# EAGLE design sensorline (EAGLE 8.1.0)
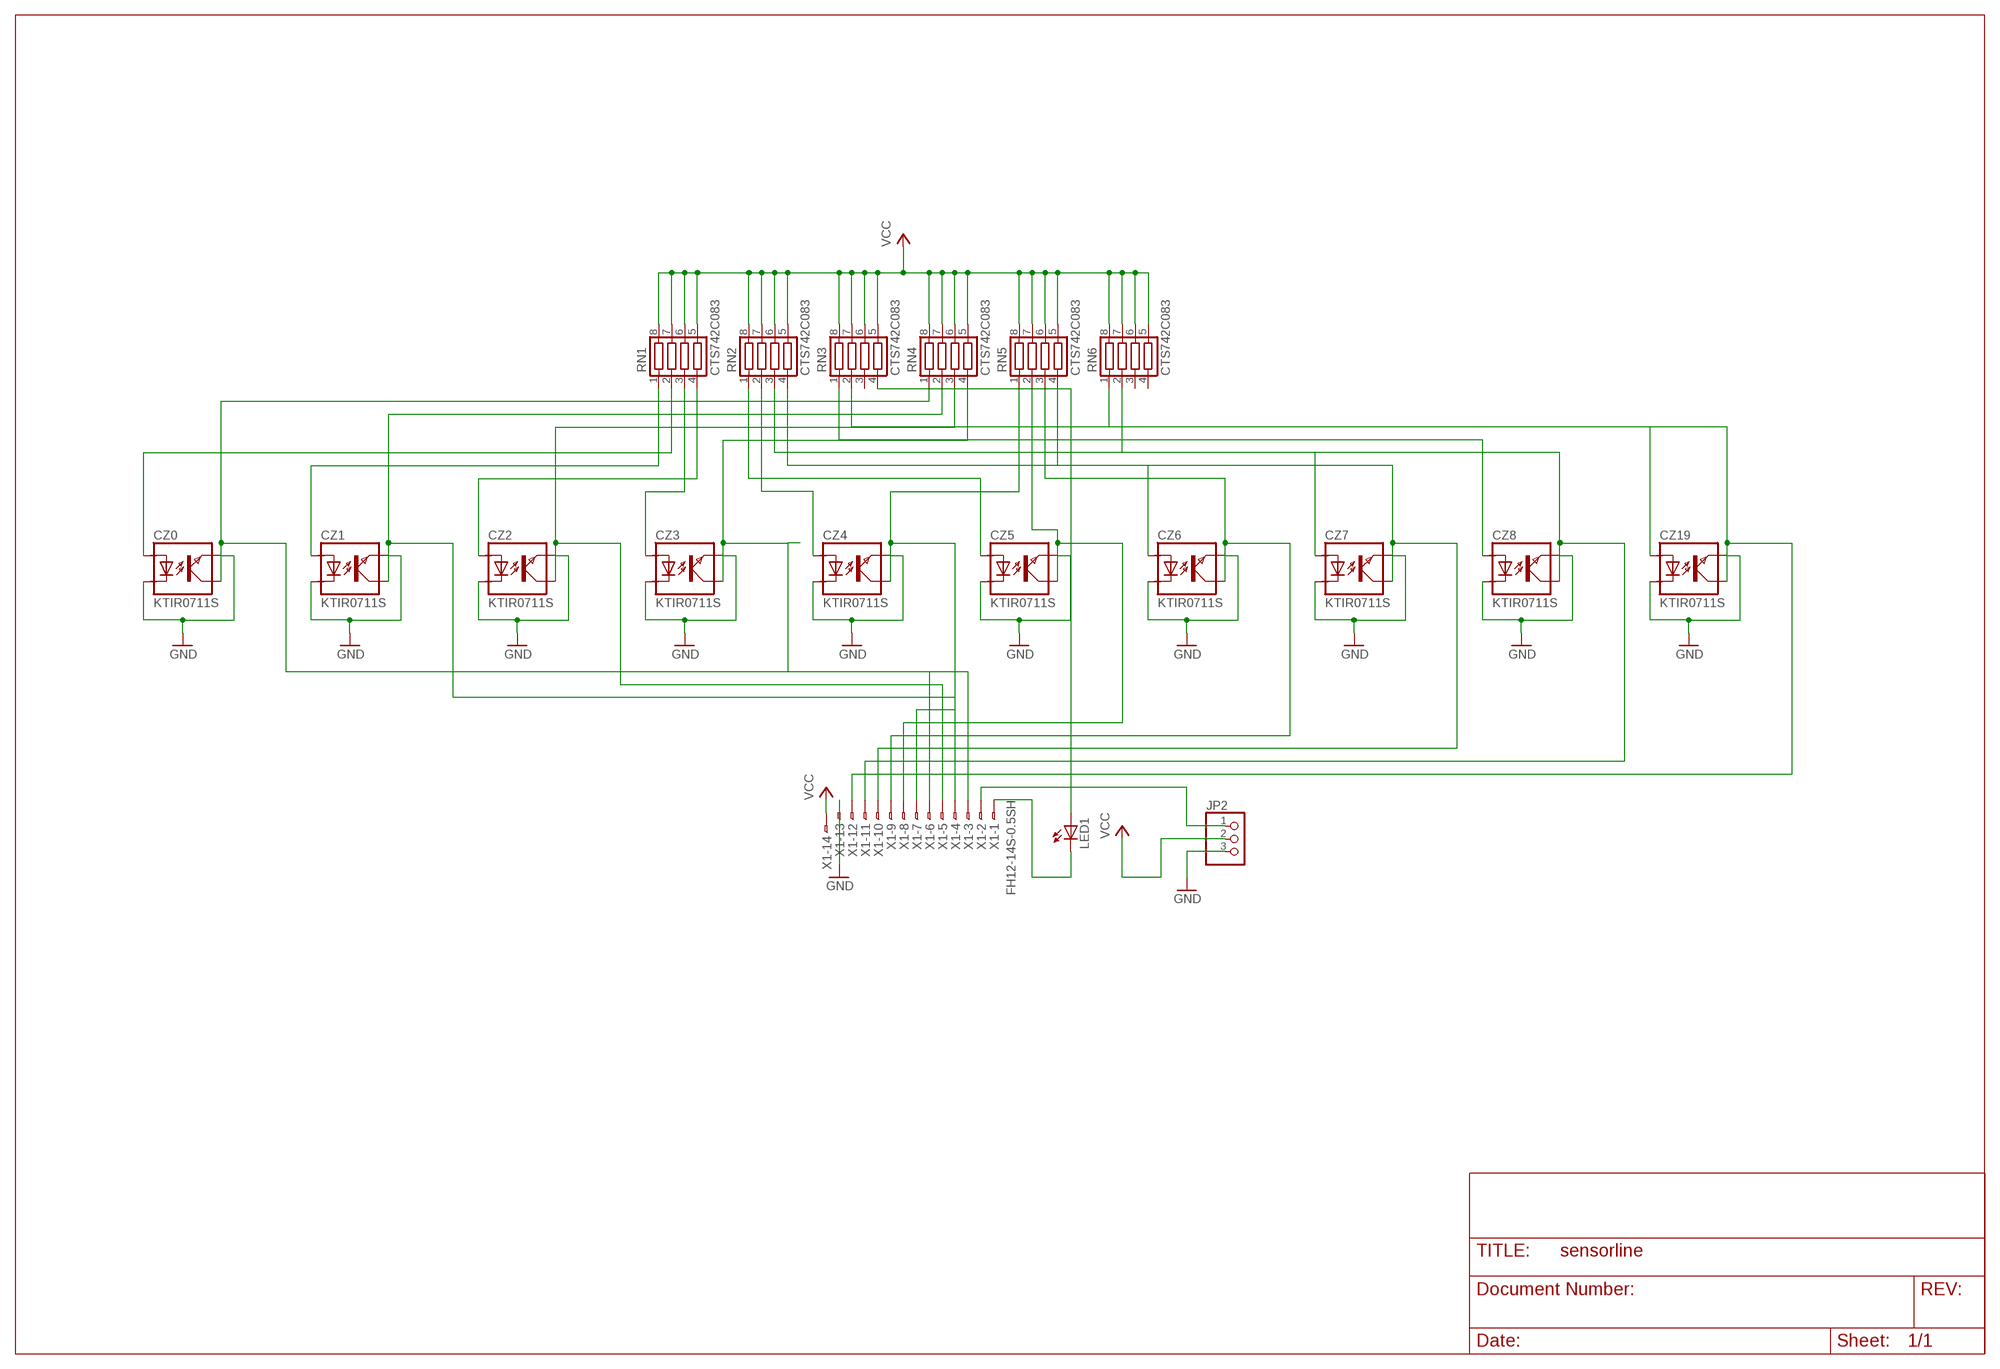
[diagram p0: schematic, sheet 1]

## Parts
CZ0  KTIR0711S  [TOP]
CZ1  KTIR0711S  [TOP]
CZ2  KTIR0711S  [TOP]
CZ3  KTIR0711S  [TOP]
CZ4  KTIR0711S  [TOP]
CZ5  KTIR0711S  [TOP]
CZ6  KTIR0711S  [TOP]
CZ7  KTIR0711S  [TOP]
CZ8  KTIR0711S  [TOP]
CZ19  KTIR0711S  [TOP]
JP2  PINHD-1X3  [1X03]
LED1  LEDCHIPLED_0603  [CHIPLED_0603]
RN1  CTS742C083  [CTS742C083]
RN2  CTS742C083  [CTS742C083]
RN3  CTS742C083  [CTS742C083]
RN4  CTS742C083  [CTS742C083]
RN5  CTS742C083  [CTS742C083]
RN6  CTS742C083  [CTS742C083]
X1  FH12-14S-0.5SH  [FH12-14S-0.5SH]

## Nets
GND: CZ0.EMITER CZ0.KATODA CZ1.EMITER CZ1.KATODA CZ2.EMITER CZ2.KATODA CZ3.EMITER CZ3.KATODA CZ4.EMITER CZ4.KATODA CZ5.EMITER CZ5.KATODA CZ6.EMITER CZ6.KATODA CZ7.EMITER CZ7.KATODA CZ8.EMITER CZ8.KATODA CZ19.EMITER CZ19.KATODA JP2.3 X1.13
N$1: CZ0.ANODA RN1.2
N$2: CZ0.KOLEKTOR RN4.1 X1.3
N$3: CZ1.ANODA RN1.1
N$4: CZ1.KOLEKTOR RN4.2 X1.4
N$5: CZ2.ANODA RN1.4
N$6: CZ2.KOLEKTOR RN4.3 X1.5
N$7: CZ3.ANODA RN1.3
N$8: CZ3.KOLEKTOR RN4.4 X1.6
N$9: CZ4.ANODA RN2.2
N$10: CZ4.KOLEKTOR RN5.1 X1.7
N$11: CZ5.ANODA RN2.1
N$12: CZ5.KOLEKTOR RN5.2 X1.8
N$13: CZ6.ANODA RN2.4
N$14: CZ6.KOLEKTOR RN5.3 X1.9
N$15: CZ7.ANODA RN2.3
N$16: CZ7.KOLEKTOR RN5.4 X1.10
N$17: CZ8.ANODA RN3.1
N$18: CZ8.KOLEKTOR RN6.2 X1.11
N$19: CZ19.ANODA RN3.2
N$20: CZ19.KOLEKTOR RN6.1 X1.12
N$21: LED1.A RN3.4
N$22: JP2.1 X1.2
N$23: LED1.C X1.1
VCC: JP2.2 RN1.5 RN1.6 RN1.7 RN1.8 RN2.5 RN2.6 RN2.7 RN2.8 RN3.5 RN3.6 RN3.7 RN3.8 RN4.5 RN4.6 RN4.7 RN4.8 RN5.5 RN5.6 RN5.7 RN5.8 RN6.5 RN6.6 RN6.7 RN6.8 X1.14
Unconnected: RN3.3 RN6.3 RN6.4

## Library data of the parts
CZ0 CZ1-CZ8 CZ19 = KTIR0711S:KTIR0711S
JP2 = pinhead:PINHD-1X3: PIN HEADER
LED1 = led:LED: LED OSRAM: - CHIPLED LG R971, LG N971, LY N971, LG Q971, LY Q971, LO R971, LY R971 LH N974, LH R974 LS Q976, LO Q976, LY Q976 LO Q996 - Hyper CHIPLED LW Q18S LB Q993, LB Q99A, LB R99A - SideLED LS A670, LO A670, LY A670, LG A670, LP A670 LB A673, LV A673, LT A673, LW A673 LH A674 LY A675 LS A676, LA A676, LO A676, LY A676, LW A676 LS A679, LY A679, LG A679 - Hyper Micro SIDELED® LS Y876, LA Y876, LO Y876, LY Y876 LT Y87S - SmartLED LW L88C, LW L88S LB L89C, LB L89S, LG L890 LS L89K, LO L89K, LY L89K LS L896, LA L896, LO L896, LY L896 - TOPLED LS T670, LO T670, LY T670, LG T670, LP T670 LSG T670, LSP T670, LSY T670, LOP T670, LYG T670 LG T671, LOG T671, LSG T671 LB T673, LV T673, LT T673, LW T673 LH T674 LS T676, LA T676, LO T676, LY T676, LB T676, LH T676, LSB T676, LW T676 LB T67C, LV T67C, LT T67C, LS T67K, LO T67K, LY T67K, LW E67C LS E67B, LA E67B, LO E67B, LY E67B, LB E67C, LV E67C, LT E67C LW T67C LS T679, LY T679, LG T679 LS T770, LO T770, LY T770, LG T770, LP T770 LB T773, LV T773, LT T773, LW T773 LH T774 LS E675, LA E675, LY E675, LS T675 LS T776, LA T776, LO T776, LY T776, LB T776 LHGB T686 LT T68C, LB T68C - Hyper Mini TOPLED® LB M676 - Mini TOPLED Santana® LG M470 LS M47K, LO M47K, LY M47K Source: http://www.osram.convergy.de LUXEON: - LUMILED® LXK2-PW12-R00, LXK2-PW12-S00, LXK2-PW14-U00, LXK2-PW14-V00 LXK2-PM12-R00, LXK2-PM12-S00, LXK2-PM14-U00 LXK2-PE12-Q00, LXK2-PE12-R00, LXK2-PE12-S00, LXK2-PE14-T00, LXK2-PE14-U00 LXK2-PB12-K00, LXK2-PB12-L00, LXK2-PB12-M00, LXK2-PB14-N00, LXK2-PB14-P00, LXK2-PB14-Q00 LXK2-PR12-L00, LXK2-PR12-M00, LXK2-PR14-Q00, LXK2-PR14-R00 LXK2-PD12-Q00, LXK2-PD12-R00, LXK2-PD12-S00 LXK2-PH12-R00, LXK2-PH12-S00 LXK2-PL12-P00, LXK2-PL12-Q00, LXK2-PL12-R00 Source: www.luxeon.com KINGBRIGHT: KA-3528ASYC Source: www.kingbright.com
RN1-RN6 = resistor-net:CTS742C083: Chip Resistor Array 4 Single Resistor Source: http://www.ctscorp.com/components/Datasheets/CTSChipArrayDs.pdf; OC_FARNELL: unknown; OC_NEWARK: unknown
X1 = con-hirose:FH12-14S-0.5S: 0.5mm Pitch Connectors For FPC/FFC Source: Data sheet <http://www.hirose.co.jp/cataloge_hp/e58605370.pdf>; MPN: MC34827; OC_FARNELL: 1324544; OC_NEWARK: 41P0493

## Board
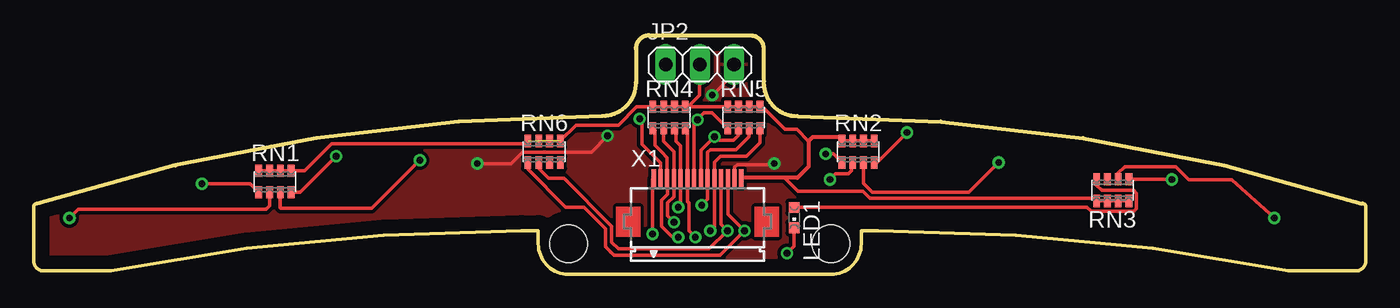
[diagram p1: board, top side]
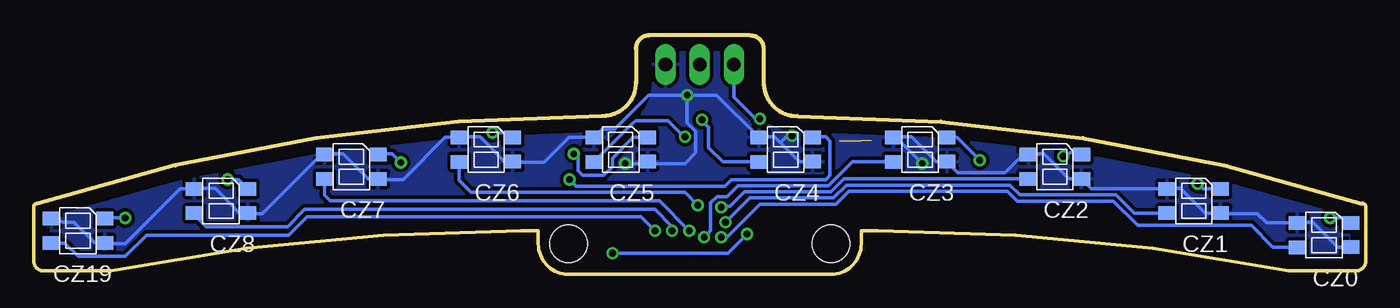
[diagram p2: board, bottom side, seen from below]

Size 99 x 17.75 mm. Coordinates in mm from the lower left corner, seen from the top.
Outline: 45.75,17.75 53.25,17.75 arc-90 54.25,16.75 54.25,14.25 arc90 56.75,11.75 arc-18 98.75,5.25 arc-90 99,5 99,1 arc-90 98.25,0.25 93.25,0.25 arc11 62.75,3.25 61.5,3.25 61.5,2.25 arc-90 59.25,0 39.75,0 arc-90 37.5,2.25 37.5,3.25 36.25,3.25 arc11 5.75,0.25 0.75,0.25 arc-90 0,1 0,5 arc-90 0.25,5.25 arc-18 42.25,11.75 arc90 44.75,14.25 44.75,16.75 arc-90 45.75,17.75
Copper layers (1*16): Top 0.035mm / dielectric 1.5mm / Bottom 0.035mm
Design rules "default": minimum track width 10mil, minimum drill 24mil, track to track 8mil, track to pad 8mil, pad to pad 8mil, via to via 8mil, smd to smd 8mil, copper to edge 40mil, drill to drill 8mil, minimum pad ring 10mil, minimum via ring 8mil, stop-mask expansion 4mil, vias tented up to drill 0mil, thermal gap 10mil
Holes 2.8 mm at 39.75,2.25 59.25,2.25

### Footprints (pad centres in the part's own frame; a part is rotated, then mirrored left to right if it is on the bottom)
TOP = smd 1.27 x 1: ANODA -1.985,-0.9; EMITER -1.985,0.9; KATODA 1.985,-0.9; KOLEKTOR 1.985,0.91
1X03 = drill 1.016 long: 1 -2.54,0; 2 0,0; 3 2.54,0
CHIPLED_0603 = smd 0.8 x 0.8: A 0,-0.75; C 0,0.75
CTS742C083 = smd 0.5 x 0.9: 1 -1.2,-0.8; 2 -0.4,-0.8; 3 0.4,-0.8; 4 1.2,-0.8; 5 1.2,0.8; 6 0.4,0.8; 7 -0.4,0.8; 8 -1.2,0.8
FH12-14S-0.5SH = smd 0.3 x 1.3: 1 -3.25,3.25; 2 -2.75,3.25; 3 -2.25,3.25; 4 -1.75,3.25; 5 -1.25,3.25; 6 -0.75,3.25; 7 -0.25,3.25; 8 0.25,3.25; 9 0.75,3.25; 10 1.25,3.25; 11 1.75,3.25; 12 2.25,3.25; 13 2.75,3.25; 14 3.25,3.25

### Placement (x,y rotation side)
CZ0  3.1,2.91 180 bottom
CZ1  12.79,5.45 180 bottom
CZ2  23.11,7.99 180 bottom
CZ3  33.11,9.26 180 bottom
CZ4  43.12,9.26 180 bottom
CZ5  55.38,9.26 180 bottom
CZ6  65.38,9.26 180 bottom
CZ7  75.39,7.99 180 bottom
CZ8  85.07,5.45 180 bottom
CZ19  95.71,3.23 180 bottom
JP2  49.5,15.59 0 top
LED1  56.52,4.21 180 top
RN1  17.93,6.88 0 top
RN2  61.27,9.1 0 top
RN3  80.18,6.25 180 top
RN4  47.22,11.64 0 top
RN5  52.77,11.64 0 top
RN6  37.93,9.1 0 top
X1  49.33,3.9 0 top

### Tracks (layer width: path | path; a pad name or v marks a point on that pad's centre or on a via)
GND  (via drill 0.5)
  Top 0.254: X1.13 52.1,7.17 52.1,7.94 52.3,8.13 54.94,8.13 v55.04,8.23 | JP2.3 52.04,14.92 v50.43,13.31 | v32.97,8.23 35.49,8.23 36.34,9.08 41.44,9.08 v42.65,10.29
  Bottom 0.254: CZ0.EMITER 2.08,2.01 3.93,3.86 5.04,3.86 CZ0.KATODA 7.37,3.81 8.06,4.5 10.75,4.5 CZ1.EMITER 11.92,4.55 13.77,6.4 14.72,6.4 CZ1.KATODA 20.39,6.35 CZ2.EMITER 22.08,7.09 23.93,8.94 25.04,8.94 CZ2.KATODA 25.48,8.89 26.83,7.54 30.3,7.54 CZ3.EMITER 31.92,8.36 33.77,10.21 35.05,10.21 CZ3.KATODA 34.9,10.16 v32.97,8.23 | CZ4.EMITER 42.08,8.36 43.49,9.77 | 43.49,9.77 43.94,10.21 45.05,10.21 CZ4.KATODA 48.25,13.31 v50.43,13.31 | CZ19.KATODA 96.79,3.86 96,3.86 94.47,2.33 CZ19.EMITER 93.03,2.28 92.19,2.28 88.12,6.35 CZ8.KATODA 87,6.4 85.53,6.4 83.67,4.55 CZ8.EMITER 83.03,4.5 82.03,4.5 77.64,8.89 CZ7.KATODA 77.32,8.94 76,8.94 74.15,7.09 CZ7.EMITER 73.35,7.04 71.56,7.04 68.44,10.16 CZ6.KATODA 67.31,10.21 65.84,10.21 63.99,8.36 CZ6.EMITER 63.34,8.31 61.08,8.31 59.23,10.16 CZ5.KATODA 56.76,10.77 55.83,10.77 53.29,13.31 v50.43,13.31 | v55.04,8.23 53.53,8.23 CZ5.EMITER 53.26,8.23 50.59,8.23 49.8,9.02 49.8,10.61 50.43,11.24 v50.43,13.31 | v42.65,10.29 42.97,10.29 43.49,9.77
  pour Top (isolate 0.254): -2.25,-2.25 -2.25,17.75 -2.25,19.75 101.75,19.75 101.75,-4.25 -2.25,-4.25
  pour Bottom (isolate 0.254): -2.25,-4.25 -2.25,19.75 101.75,19.75 101.75,-4.25
N$1  (via drill 0.5)
  Top 0.254: RN1.2 17.53,5.08 17.27,4.81 3.3,4.81 v2.66,4.18
  Bottom 0.254: v2.66,4.18 1.49,4.18 CZ0.ANODA
N$2  (via drill 0.5)
  Top 0.254: X1.3 47.08,6.69 | X1.3 47.08,8.66 46.66,9.08 46.65,9.08 46.16,9.58 46.16,10.7 RN4.1 | X1.3 47.1,7.13 47.1,5.93 46.66,5.49 46.66,3.58 47.42,2.83 47.98,2.83 v47.9,2.75
  Bottom 0.254: CZ0.KOLEKTOR 6.9,2 8.52,3.62 16.95,3.62 18.76,5.44 25.91,5.44 26.64,6.17 38.41,6.17 39.37,5.21 45.04,5.21 47.42,2.83 47.98,2.83 v47.9,2.75
N$3  (via drill 0.5)
  Top 0.254: v12.5,6.72 16.09,6.72 RN1.1
  Bottom 0.254: CZ1.ANODA 12.13,6.35 v12.5,6.72
N$4  (via drill 0.5)
  Top 0.254: RN4.2 46.79,10.81 46.79,9.89 47.58,9.11 X1.4 47.58,5.76 47.12,5.3 47.12,4.33 v47.59,3.86
  Bottom 0.254: 15.13,4.18 CZ1.KOLEKTOR 17.22,4.54 18.57,5.89 25.71,5.89 26.45,6.62 38.6,6.62 39.56,5.67 45.78,5.67 v47.59,3.86
N$5  (via drill 0.5)
  Top 0.254: RN1.4 19.8,6.08 v22.48,8.76
  Bottom 0.254: v22.48,8.76 21.5,9.26 CZ2.ANODA
N$6  (via drill 0.5)
  Top 0.254: RN4.3 47.74,10.71 47.74,9.89 48.08,9.56 X1.5 48.08,5.15 v47.9,4.97
  Bottom 0.254: CZ2.KOLEKTOR 38.79,7.08 39.75,6.12 46.19,6.12 47.26,5.05 47.83,5.05 v47.9,4.97
N$7  (via drill 0.5)
  Top 0.254: RN1.3 18.33,4.93 18.37,4.89 25.12,4.89 v28.7,8.47
  Bottom 0.254: CZ3.ANODA 30.39,10.16 v28.7,8.47
N$8  (via drill 0.5)
  Top 0.254: RN4.4 48.58,10.68 X1.6 48.58,5.4 48.69,5.3 48.69,3.24 v49.17,2.75
  Bottom 0.254: CZ3.KOLEKTOR 38.17,8.35 39.94,6.58 46.65,6.58 47.48,5.76 48.23,5.76 48.69,5.3 48.69,3.24 v49.17,2.75
N$9  (via drill 0.5)
  Top 0.254: v59.17,7.04 59.6,7.46 60.55,7.46 60.76,7.67 60.76,8.2 RN2.2
  Bottom 0.254: CZ4.ANODA 41.08,10.21 40.12,10.21 39.81,9.89 39.81,7.36 40.12,7.04 47.13,7.04 47.63,6.54 58.68,6.54 v59.17,7.04 58.86,6.72
N$10  (via drill 0.5)
  Top 0.254: X1.7 49.08,11.23 v49.33,11.48 49.83,11.98 50.42,11.98 RN5.1
  Bottom 0.254: CZ4.KOLEKTOR 47.79,8.35 48.84,9.41 48.84,10.93 49.33,11.41 v49.33,11.48
N$11  (via drill 0.5)
  Top 0.254: v58.86,8.94 59.42,8.94 RN2.1
  Bottom 0.254: CZ5.ANODA 54.47,10.16 56,8.62 56,7.99 56.63,7.36 58.22,7.36 58.54,7.67 58.54,8.62 v58.86,8.94
N$12  (via drill 0.5)
  Top 0.254: X1.8 49.58,9.2 50.1,9.72 50.11,9.72 v50.6,10.21 50.84,9.97 52.02,9.97 52.38,10.33 RN5.2
  Bottom 0.254: v50.6,10.21 50.67,10.21 51.86,11.4 54.24,11.4 54.56,11.13 54.62,11.1 CZ5.KOLEKTOR
N$13  (via drill 0.5)
  Top 0.254: RN2.4 62.66,8.3 v64.89,10.53
  Bottom 0.254: v64.89,10.53 63.77,10.53 CZ6.ANODA
N$14  (via drill 0.5)
  Top 0.254: v49.65,5.13 50.08,5.56 X1.9 50.08,9.06 50.28,9.26 52.19,9.26 53.14,10.21 53.14,10.81 RN5.3
  Bottom 0.254: CZ6.KOLEKTOR 67.37,6.97 66.48,6.08 50.6,6.08 v49.65,5.13
N$15  (via drill 0.5)
  Top 0.254: RN2.3 61.67,6.77 62.35,6.08 69.49,6.08 v71.72,8.31
  Bottom 0.254: CZ7.ANODA 73.35,8.94 72.35,8.94 v71.72,8.31
N$16  (via drill 0.5)
  Top 0.254: v50.28,3.23 50.58,3.53 X1.10 50.6,7.49 50.6,8.31 51.06,8.77 52.97,8.77 53.98,9.78 RN5.4
  Bottom 0.254: CZ7.KOLEKTOR 77.37,5.87 76.95,5.45 52.51,5.45 v50.28,3.23
N$17  (via drill 0.5)
  Top 0.254: RN3.1 84.25,7.04 v84.58,7.04
  Bottom 0.254: v84.58,7.04 83.77,7.04 CZ8.ANODA
N$18  (via drill 0.5)
  Top 0.254: X1.11 51.08,3.7 v51.55,3.23 50.2,1.88 43.45,1.88 42.95,2.37 42.95,3.58 39.41,7.12 38.28,7.12 37.53,7.87 RN6.2
  Bottom 0.254: CZ8.KOLEKTOR 86.75,4.54 86.75,4.14 86.16,3.54 80.13,3.54 78.86,4.81 52.83,4.81 51.55,3.54 v51.55,3.23
N$19  (via drill 0.5)
  Top 0.254: RN3.2 80.58,7.49 81.08,7.99 84.89,7.99 85.84,7.04 89.02,7.04 v92.19,4.18
  Bottom 0.254: v92.19,4.18 93.03,4.18 CZ19.ANODA
N$20  (via drill 0.5)
  Top 0.254: X1.12 51.58,4.47 v52.83,3.23 51,1.4 43.13,1.4 | 42.88,1.64 42.89,1.64 43.13,1.4 | 43.13,1.4 42.49,2.04 42.49,3.39 40.89,4.99 39.54,4.99 36.73,7.8 RN6.1
  Bottom 0.254: CZ19.KOLEKTOR 96.68,2.32 95.69,1.32 92.19,1.32 90.61,2.91 80.04,2.91 78.69,4.26 53.85,4.26 v52.83,3.23
N$21
  Top 0.254: LED1.A 58.08,4.96 58.11,4.99 78.27,4.99 78.6,4.67 81.77,4.67 81.96,4.86 81.96,6.03 81.77,6.22 79.38,6.22 78.98,6.63 RN3.4
N$22  (via drill 0.5)
  Top 0.254: X1.2 46.58,8.27 45.19,9.65 45.19,11.24 45.03,11.4 v45.03,11.56
  Bottom 0.254: v45.03,11.56 45.35,11.56 46.94,13.15 46.94,15.56 JP2.1
N$23  (via drill 0.5)
  Top 0.254: LED1.C 56.52,3.4 56.51,3.39 56.51,2.08 v55.99,1.56 | v45.99,2.99 45.99,7.06 X1.1
  Bottom 0.254: v55.99,1.56 47.42,1.56 v45.99,2.99
VCC  (3 unrouted)
  Top 0.254: RN4.5 RN4.6 RN4.7 RN4.8 44.8,12.44 43.45,11.08 40.31,11.08 RN6.5 | RN4.5 RN5.8 RN5.7 RN5.6 RN5.5 54.16,12.44 55.83,10.77 56.72,10.77 57.59,9.89 | RN1.8 RN1.7 RN1.6 RN1.5 20.13,7.68 22.16,9.71 36.42,9.71 RN6.8 | RN2.5 RN2.6 RN2.7 RN2.8 | RN3.8 RN3.7 RN3.6 RN3.5 78.8,5.63 62.16,5.63 61.63,6.16 56.78,6.16 55.79,7.15 X1.14 | RN4.5 48.61,12.44 49.48,13.31 49.48,15.56 JP2.2
  Top 0.305: X1.14 56.75,7.15 57.59,7.99 57.59,9.89 57.91,10.21 59.76,10.21 RN2.8